# EasyEDA Pro project 宠物喂食机-V1.eprj

# Schematic Schematic1
Create Date: 2023-04-14; Page Name: P1; Project Name: 宠物喂食机-V1; Schematic Name: Schematic1; Update Date: 2023-04-15; Company: 嘉立创EDA; Page Size: A4; Version: V1.0
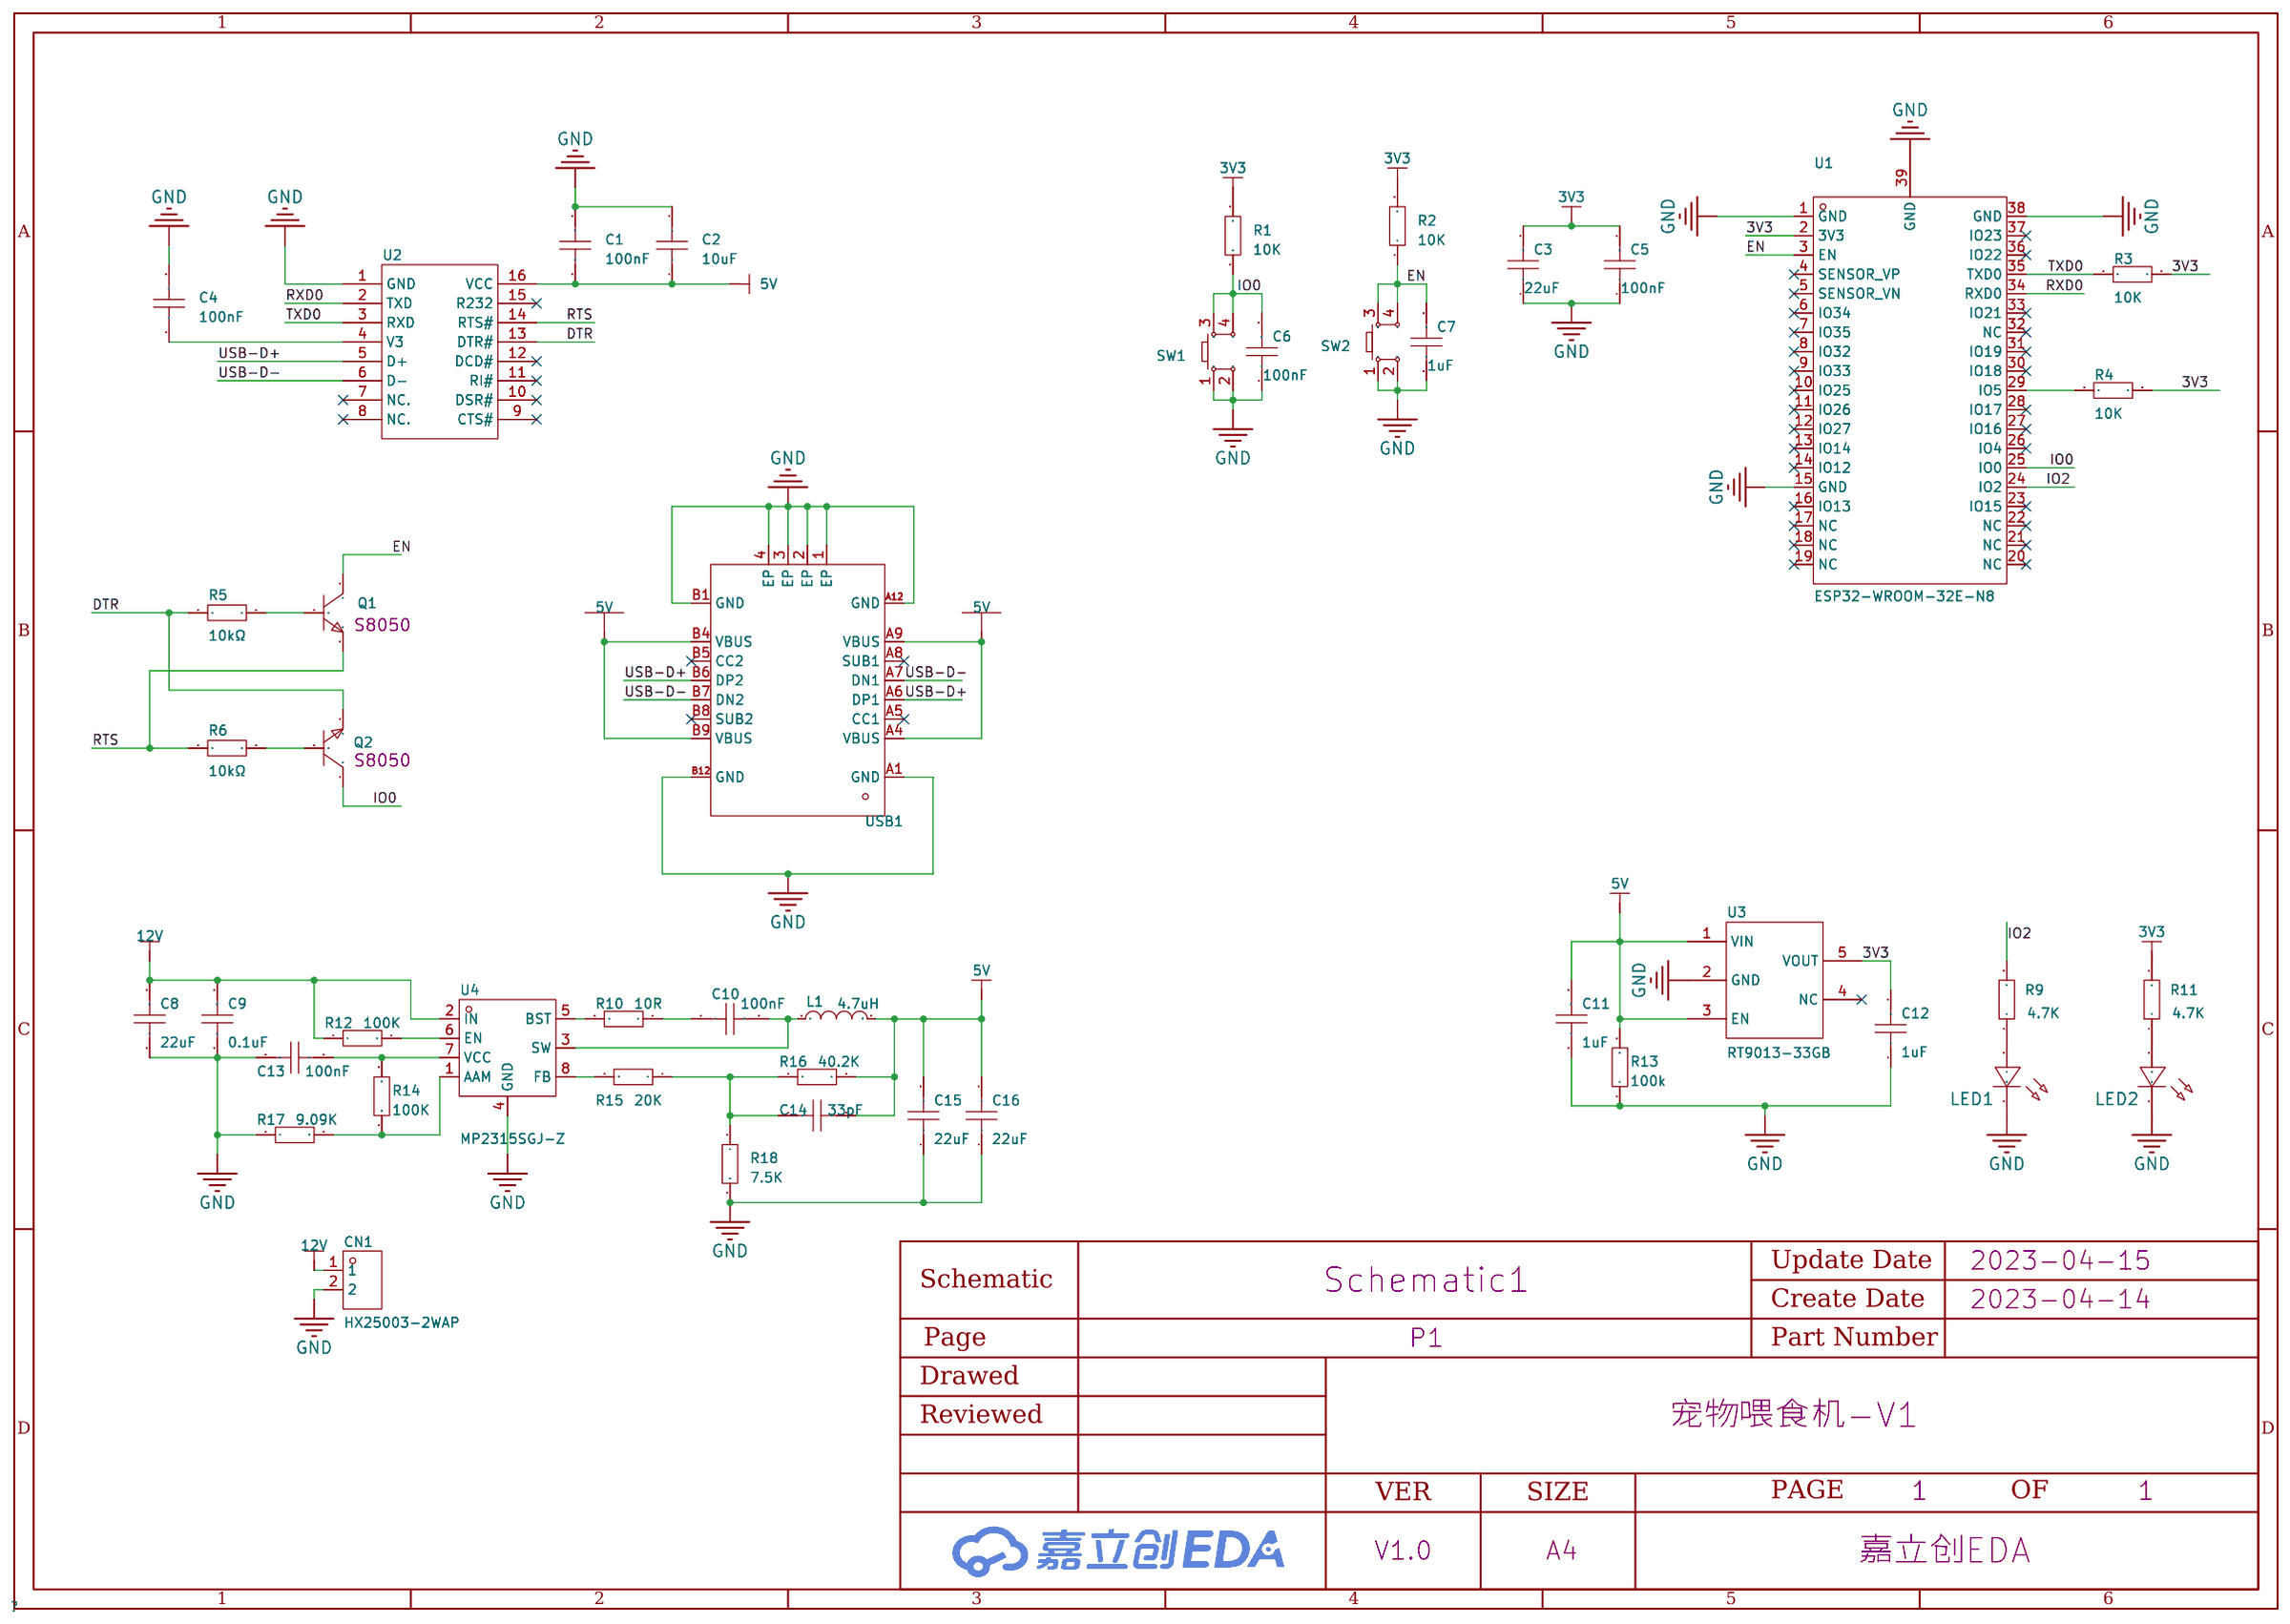
[diagram p0: schematic sheet]

## Parts
C1  100nF  [C0603]
C2  10uF  [C0603]
C3  22uF  [C0603]
C4  100nF  [C0603]
C5  100nF  [C0603]
C6  100nF  [C0603]
C7  1uF  [C0603]
C8  22uF  [C1206]
C9  0.1uF  [C0805]
C10  100nF  [C0603]
C11  1uF  [C0603_1]
C12  1uF  [C0603_1]
C13  100nF  [C0603]
C14  33pF  [C0603]
C15  22uF  [C0805]
C16  22uF  [C0805]
CN1  HX25003-2WAP  [CONN-TH_2P-P2.50_HX25003-2WAP]
L1  4.7uH  [IND-SMD_L7.3-W6.6]
LED1  -  [LED_0603]
LED2  -  [LED_0603]
Q1  -  [S8050_SOT-23]
Q2  -  [S8050_SOT-23]
R1  10K  [R0603]
R2  10K  [R0603]
R3  10K  [R0603]
R4  10K  [R0603]
R5  10kΩ  [R0603]
R6  10kΩ  [R0603]
R9  4.7K  [R0603]
R10  10R  [R0603]
R11  4.7K  [R0603]
R12  100K  [R0603]
R13  100k  [R0603]
R14  100K  [R0603]
R15  20K  [R0603]
R16  40.2K  [R0603]
R17  9.09K  [R0603]
R18  7.5K  [R0603]
SW1  -  [KEY-SMD_4P-L4.5-W4.5-P3.00-LS6.8]
SW2  -  [KEY-SMD_4P-L4.5-W4.5-P3.00-LS6.8]
U1  ESP32-WROOM-32E-N8  [WIFI-SMD_ESP32-WROOM-32E]
U2  CH340C  [SOP-16_L10.0-W3.9-P1.27-LS6.0-BL]
U3  RT9013-33GB  [SOT-23-5_L3.0-W1.7-P0.95-LS2.8-BL]
U4  MP2315SGJ-Z  [TSOT-23-8_L2.9-W1.6-P0.65-LS2.8-BL]
USB1  -  [USB-C-SMD_KH-TYPE-C-16P_1]

## Library data of the parts
C1-C7 = CAP_0805: Supplier Footprint: 0805
C8 = CAP_1206: Supplier Footprint: 1206
C9 C10 C14-C16 = CAP_0603: Supplier Footprint: 0603
C11 C12 = CAP_604: Supplier Footprint: 0603; Check: true
C13 = CL05B104KO5NNNC: 容值:100nF;精度:±10%;额定电压:16V;材质(温度系数):X7R;; LCSC Part Name: 100nF ±10% 16V; Supplier Part: C1525; Manufacturer: SAMSUNG(三星); Supplier Footprint: 0402; JLCPCB Part Class: Basic Part; Datasheet: https://atta.szlcsc.com/upload/public/pdf/source/20160103/1457707674891.pdf; Supplier: LCSC; Tolerance: ±10%; Voltage Rated: 16V; Temperature Coefficient: X7R
CN1 = HX25003-2WAP: 参考系列:XH;间距:2.5mm;插针结构:1x2P;排数:1;每排PIN数:2;行距:-;公母:公型插针;安装方式:弯插;额定电流:-;工作温度范围:-;; LCSC Part Name: XH 2.5mm 1x2P 弯插 母座; Supplier Part: C442326; Manufacturer: HX(红星); Supplier Footprint: 插件,P=2.5mm; JLCPCB Part Class: Extended Part; Datasheet: https://atta.szlcsc.com/upload/public/pdf/source/20191028/C442326_951D1FF48F4BC139C99E649B2A876D28.pdf; Supplier: LCSC; Reference Series: XH; Pitch: 2.5mm; Pins Structure: 1x2P; Number of Rows: 1; Number of PINs Per Row: 2; Gender: 公型插针; Mounting Style: 弯插
L1 = MCS0630-4R7MPY1: 电感值:4.7uH;精度:±20%;额定电流:5.5A;饱和电流(Isat):7A;; LCSC Part Name: 4.7uH ±20% 5.5A 37mΩ; Supplier Part: C2937097; Manufacturer: PSA(信昌电陶); Supplier Footprint: 0630; JLCPCB Part Class: Extended Part; Datasheet: https://atta.szlcsc.com/upload/public/pdf/source/20220121/EA6E6E6F70ED7BAE67EC293805EAAACB.pdf; Supplier: LCSC; Tolerance: ±20%; Rated Current: 5.5A; Saturation Current (Isat): 7A; DC Resistance (DCR): 37mΩ
LED1 LED2 = LED_0603-R: Supplier Footprint: 0603; Check: true
Q1 Q2 = S8050_SOT_NPN: Supplier Footprint: SOT-23; Manufacturer Part: S8050
R1-R4 R9-R18 = Res_0603: Supplier Footprint: 0603; Check: true
R5 R6 = 0402WGF1202TCE: 电阻类型:厚膜电阻;阻值:12kΩ;精度:±1%;功率:62.5mW;温度系数:±100ppm/℃;最大工作电压:50V;工作温度范围:-55℃~+155℃;; LCSC Part Name: 12kΩ ±1% 62.5mW; Supplier Part: C25752; Manufacturer: UNI-ROYAL(厚声); Supplier Footprint: 0402; JLCPCB Part Class: Basic Part; Datasheet: https://atta.szlcsc.com/upload/public/pdf/source/20200306/C422600_1E6D84923E4A46A82E41ADD87F860B5C.pdf; Supplier: LCSC; Type: 厚膜电阻; Tolerance: ±1%; Power(Watts): 62.5mW; Temperature Coefficient: ±100ppm/℃; Overload Voltage (Max): 50V; Operating Temperature Range: -55℃~+155℃
SW1 SW2 = Key_SMD_12x12x7.3: Supplier Footprint: SMD
U1 = ESP32-WROOM-32E-N8_C701342: ESP32-WROOM-32E 集成 ESP32-D0WD-V3 芯片，具有?高的稳定性和安全性能。; LCSC Part Name: PCB板载天线模组; Supplier Part: C701342; Manufacturer: ESPRESSIF(乐鑫); Supplier Footprint: SMD-38P,18x25.5x3.1mm; JLCPCB Part Class: Extended Part; Datasheet: https://atta.szlcsc.com/upload/public/pdf/source/20200730/C701341_95E089979D39CD8D2471FDC7C7AF29A1.pdf; Supplier: LCSC
U2 = CH340C: 类型:Transceiver;协议类别:USB 2.0;驱动器/接收器数:-;数据速率:2Mbps;; Supplier Part: C84681; Manufacturer: WCH(南京沁恒); Supplier Footprint: SOP-16_150mil; JLCPCB Part Class: 扩展库; Datasheet: https://atta.szlcsc.com/upload/public/pdf/source/20200819/C84681_ADBED554CE321879DBD6B1D06488689C.pdf; Supplier: LCSC; Type: Transceiver; Protocol: USB 2.0; Data Rate: 2Mbps; Supply Voltage: 3.3V, 5V
U3 = RT9013-33GB: 输出类型:固定;输出极性:正;输出通道数:1;最大输入电压:5.5V;输出电压:3.3V;压差:400mV@(500mA);静态电流(地电流):-;输出电流:500mA;电源纹波抑制比(PSRR):50dB@(10kHz);噪声:-;特性:-;; LCSC Part Name: 正 Vin=5.5V Vout=3.3V 500mA 50dB@(10kHz); Supplier Part: C47773; Manufacturer: RICHTEK(立锜); Supplier Footprint: SOT-23-5; JLCPCB Part Class: Extended Part; Datasheet: https://atta.szlcsc.com/upload/public/pdf/source/20150504/1457707282459.pdf; Supplier: LCSC; Output Type: 固定; Output Polarity: 正; Number of Outputs: 1; Maximum Input Voltage: 5.5V; Output Voltage: 3.3V; Dropout Voltage: 400mV@(500mA); Output Current: 500mA; Power Supply Rejection Ratio (PSRR): 50dB@(10kHz)
U4 = MP2315SGJ-Z: Supplier Part: C3031493; Supplier Footprint: TSOT23-8; JLCPCB Part Class: Extended Part; Datasheet: https://atta.szlcsc.comnull; Supplier: LCSC
USB1 = kh-type-c-16p_2: Type-C母座 16PIN 立式四角贴板无压片; LCSC Part Name: Type-C母座; Supplier Part: C709357; Manufacturer: kinghelm(金航标); Manufacturer Part: KH-TYPE-C-16P; LCSC Stock: 5637; LCSC On Sale: 1; Price: 0.484; JLCPCB Part Class: Extended Part; JLCPCB Stock: 2220; JLCPCB On Sale: 1; Datasheet: https://atta.szlcsc.com/upload/public/pdf/source/20200911/C709357_AA8DCEB38BB20E3035A7ED7AE7667837.pdf; Supplier: LCSC; Check: true

## Nets
3V3: C3.2 C5.2 C12.2 R1.2 R2.2 R3.1 R4.1 R11.2 U1.2(3V3) U3.5(VOUT)
5V: C1.1 C2.1 C11.2 C14.2 C15.2 C16.2 L1.2 R13.2 R16.2 U2.16(VCC) U3.1(VIN) U3.3(EN) USB1.A4(VBUS) USB1.A9(VBUS) USB1.B4(VBUS) USB1.B9(VBUS)
12V: C8.2 C9.2 CN1.1 R12.1 U4.2(IN)
GND: C1.2 C2.2 C3.1 C4.2 C5.1 C6.1 C7.1 C8.1 C9.1 C11.1 C12.1 C13.2 C15.1 C16.1 CN1.2 LED1.1(C) LED2.1(C) R13.1 R17.1 R18.2 SW1.1 SW1.2 SW2.1 SW2.2 U1.1(GND) U1.15(GND) U1.38(GND) U1.39(GND) U2.1(GND) U3.2(GND) U4.4(GND) USB1.1(EP) USB1.2(EP) USB1.3(EP) USB1.4(EP) USB1.A1(GND) USB1.A12(GND) USB1.B1(GND) USB1.B12(GND)
DTR: Q2.2 R5.1 U2.13(DTR#)
EN: C7.2 Q1.3 R2.1 SW2.3 SW2.4 U1.3(EN)
IO0: C6.2 Q2.3 R1.1 SW1.3 SW1.4 U1.25(IO0)
IO2: R9.2 U1.24(IO2)
RTS: Q1.2 R6.1 U2.14(RTS#)
RXD0: U1.34(RXD0) U2.2(TXD)
TXD0: R3.2 U1.35(TXD0) U2.3(RXD)
USB-D+: U2.5(D+) USB1.A6(DP1) USB1.B6(DP2)
USB-D-: U2.6(D-) USB1.A7(DN1) USB1.B7(DN2)
$C4_1: C4.1 U2.4(V3)
$C10_1: C10.1 R10.1
$C10_2: C10.2 L1.1 U4.3(SW)
$C13_1: C13.1 R14.2 U4.7(VCC)
$C14_1: C14.1 R15.1 R16.1 R18.1
$LED1_2: LED1.2(A) R9.1
$LED2_2: LED2.2(A) R11.1
$Q1_1: Q1.1 R5.2
$Q2_1: Q2.1 R6.2
$R4_2: R4.2 U1.29(IO5)
$R10_2: R10.2 U4.5(BST)
$R12_2: R12.2 U4.6(EN)
$R14_1: R14.1 R17.2 U4.1(AAM)
$R15_2: R15.2 U4.8(FB)

Not connected (* = marked no-connect by the designer): U1 4(SENSOR_VP)* 5(SENSOR_VN)* 6(IO34)* 7(IO35)* 8(IO32)* 9(IO33)* 10(IO25)* 11(IO26)* 12(IO27)* 13(IO14)* 14(IO12)* 16(IO13)* 17(NC)* 18(NC)* 19(NC)* 20(NC)* 21(NC)* 22(NC)* 23(IO15)* 26(IO4)* 27(IO16)* 28(IO17)* 30(IO18)* 31(IO19)* 32(NC)* 33(IO21)* 36(IO22)* 37(IO23)*; U2 7(NC.)* 8(NC.)* 9(CTS#)* 10(DSR#)* 11(RI#)* 12(DCD#)* 15(R232)*; U3 4(NC)*; USB1 A5(CC1)* A8(SUB1)* B5(CC2)* B8(SUB2)*

# Board PCB2
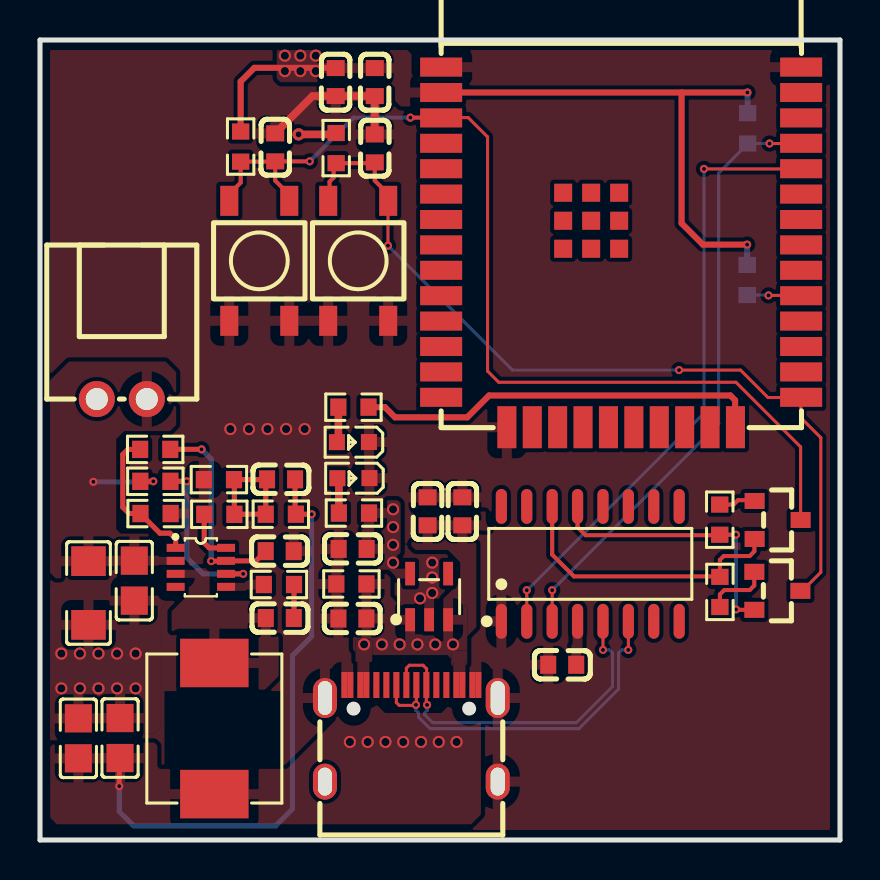
[diagram p1: board, top side]
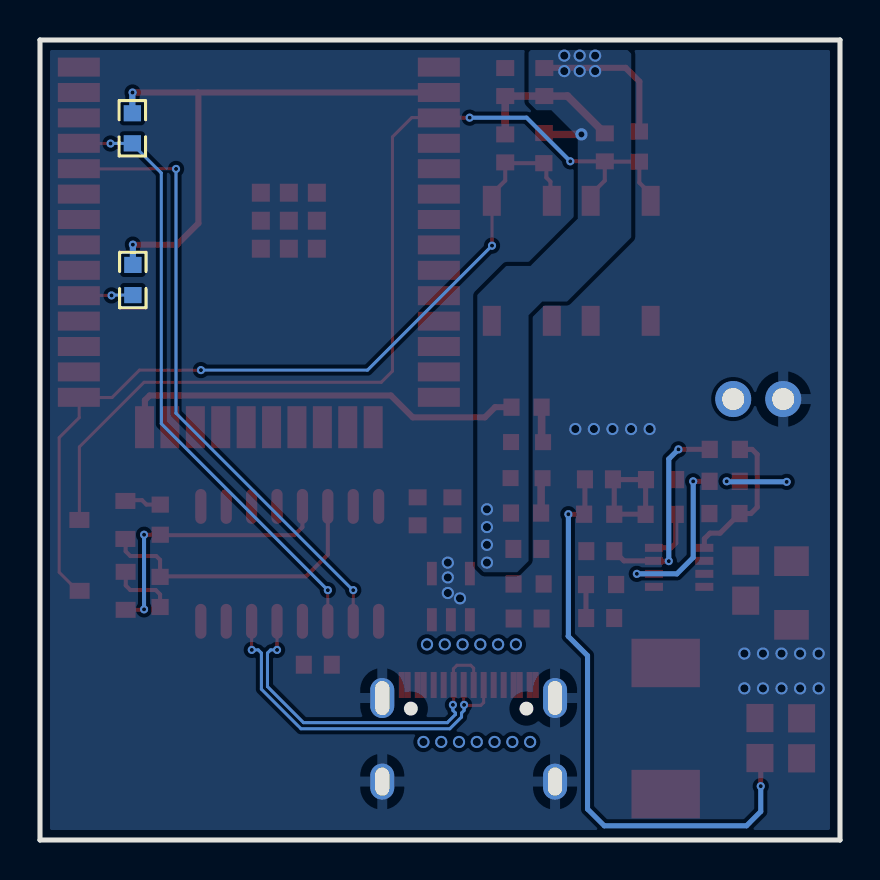
[diagram p2: board, bottom side, seen from below]

Outline 40 x 40 mm; copper layers: Top Layer, Bottom Layer. Coordinates in mm from the lower left corner of the outline.
Outline path: 0,0 0,40 40,40 40,0 0,0
Stack: Top Layer 0.035mm / Dielectric1 1.51mm FR4 er 4.5 / Bottom Layer 0.035mm

## Design rules (mm)
net GND: PWR
net USB-D+: DP1
net USB-D-: DP1
net 5V: PWR
net 3V3: PWR
net 12V: PWR
spacing safeClearance (default): track to track 0.152, other pairs 0.152 to 0.508
track width trackWidth (default): min 0.127, default 0.254, max 2.54
differential pair differentialPair (default): width min 0.127, default 0.254, max 2.54; gap min 0.152, default 0.152
via viaSize (default): diameter min 0.406, default 0.61, max 10; hole min 0.203, default 0.305, max 5.999

## Placement (name value [footprint] x y rotation side)
C1  100nF  [C0603]  21.12 16.43 90 top
C2  10uF  [C0603]  19.38 16.43 90 top
C3  22uF  [C0603]  14.78 37.9 90 top
C4  100nF  [C0603]  26.11 8.76 180 top
C5  100nF  [C0603]  16.74 37.9 90 top
C6  100nF  [C0603]  16.74 34.58 270 top
C7  1uF  [C0603]  11.76 34.63 270 top
C8  22uF  [C1206]  2.42 12.35 90 top
C9  0.1uF  [C0805]  4.72 12.97 90 top
C10  100nF  [C0603]  11.99 11.1 180 top
C11  1uF  [C0603_1]  15.62 11.07 0 top
C12  1uF  [C0603_1]  15.63 14.55 0 top
C13  100nF  [C0603]  11.99 14.44 0 top
C14  33pF  [C0603]  12.05 18.03 0 top
C15  22uF  [C0805]  4 5.1 270 top
C16  22uF  [C0805]  1.92 5.08 270 top
CN1  HX25003-2WAP  [CONN-TH_2P-P2.50_HX25003-2WAP]  4.09 22.05 180 top
L1  4.7uH  [IND-SMD_L7.3-W6.6]  8.72 5.57 90 top
LED1  -  [LED_0603]  15.6 19.89 180 top
LED2  -  [LED_0603]  15.62 18.08 180 top
Q1  -  [S8050_SOT-23]  36.88 16.13 180 top
Q2  -  [S8050_SOT-23]  36.87 12.59 180 top
R1  10K  [R0603]  14.81 34.59 90 top
R2  10K  [R0603]  10.03 34.67 90 top
R3  10K  [R0603]  35.38 35.59 270 bottom
R4  10K  [R0603]  35.36 28 270 bottom
R5  10kΩ  [R0603]  33.99 16.02 90 top
R6  10kΩ  [R0603]  34 12.4 270 top
R9  4.7K  [R0603]  15.67 21.64 0 top
R10  10R  [R0603]  11.95 12.77 180 top
R11  4.7K  [R0603]  15.7 16.35 0 top
R12  100K  [R0603]  5.77 17.94 0 top
R13  100k  [R0603]  15.57 12.8 0 top
R14  100K  [R0603]  5.76 19.53 0 top
R15  20K  [R0603]  8.97 16.28 180 top
R16  40.2K  [R0603]  12.04 16.29 0 top
R17  9.09K  [R0603]  5.78 16.32 180 top
R18  7.5K  [R0603]  8.95 18.02 180 top
SW1  -  [KEY-SMD_4P-L4.5-W4.5-P3.00-LS6.8]  15.91 28.96 90 top
SW2  -  [KEY-SMD_4P-L4.5-W4.5-P3.00-LS6.8]  10.97 28.96 90 top
U1  ESP32-WROOM-32E-N8  [WIFI-SMD_ESP32-WROOM-32E]  29.06 29.64 270 top
U2  CH340C  [SOP-16_L10.0-W3.9-P1.27-LS6.0-BL]  27.51 13.81 0 top
U3  RT9013-33GB  [SOT-23-5_L3.0-W1.7-P0.95-LS2.8-BL]  19.46 12.17 0 top
U4  MP2315SGJ-Z  [TSOT-23-8_L2.9-W1.6-P0.65-LS2.8-BL]  8.04 13.63 270 top
USB1  -  [USB-C-SMD_KH-TYPE-C-16P_1]  18.57 5.33 0 top

## Footprints (pads in the part's own frame, mm; a bottom-side part is the same pattern mirrored in y, then rotated)
C0603
  rect 0.8x0.9 smd: 1(-0.7,0) 2(0.7,0)
C0603_1
  rect 0.8x0.9 smd: 1(-0.7,0) 2(0.7,0)
C0805
  rect 1.41x1.35 smd: 1(-1,0) 2(1,0)
C1206
  rect 1.485x1.728 smd: 1(-1.593,0) 2(1.593,0)
CONN-TH_2P-P2.50_HX25003-2WAP
  round 1.8 hole 1.1: 1(-1.25,0) 2(1.25,0)
IND-SMD_L7.3-W6.6
  rect 2.424x3.42 smd: 1(3.278,0) 2(-3.278,0)
KEY-SMD_4P-L4.5-W4.5-P3.00-LS6.8
  rect 1.5x0.9 smd: 1(-3,1.5) 2(-3,-1.5) 3(3,-1.5) 4(3,1.5)
LED_0603
  rect 0.8x0.8 smd: 1(-0.851,-0.01) 2(0.75,-0.005)
R0603
  rect 0.806x0.864 smd: 1(-0.753,0) 2(0.753,0)
S8050_SOT-23
  rect 1x0.8 smd: 1(1.15,-0.823) 2(1.15,1.077) 3(-1.15,0.127)
SOP-16_L10.0-W3.9-P1.27-LS6.0-BL
  oval 0.56x1.745 smd: 1(-4.445,-2.873) 2(-3.175,-2.873) 3(-1.905,-2.873) 4(-0.635,-2.873) 5(0.635,-2.873) 6(1.905,-2.873) 7(3.175,-2.873) 8(4.445,-2.873) 9(4.445,2.873) 10(3.175,2.873) 11(1.905,2.873) 12(0.635,2.873) 13(-0.635,2.873) 14(-1.905,2.873) 15(-3.175,2.873) 16(-4.445,2.873)
SOT-23-5_L3.0-W1.7-P0.95-LS2.8-BL
  rect 0.49x1.157 smd: 1(-0.95,-1.153) 2(0,-1.153) 3(0.95,-1.153)
  rect 0.49x1.175 smd: 4(0.95,1.153) 5(-0.95,1.153)
TSOT-23-8_L2.9-W1.6-P0.65-LS2.8-BL
  rect 0.4x0.9 smd: 1(-0.975,-1.26) 2(-0.325,-1.26) 3(0.325,-1.26) 4(0.975,-1.26) 5(0.975,1.26) 6(0.325,1.26) 7(-0.325,1.26) 8(-0.975,1.26)
USB-C-SMD_KH-TYPE-C-16P_1
  oval 1.2x2 hole 0.7x1.7: 1(-4.32,1.765) 2(4.32,1.765)
  oval 1.2x1.8 hole 0.7x1.4: 3(-4.32,-2.415) 4(4.32,-2.415)
  rect 0.3x1.3 smd: A1(-3.35,2.415) A4(-2.55,2.415) A5(-1.25,2.415) A6(-0.25,2.415) A7(0.25,2.415) A8(1.25,2.415) A9(2.55,2.415) A12(3.35,2.415) B1(3.05,2.415) B4(2.25,2.415) B5(1.75,2.415) B6(0.75,2.415) B7(-0.75,2.415) B8(-1.75,2.415) B9(-2.25,2.415) B12(-3.05,2.415)
WIFI-SMD_ESP32-WROOM-32E
  rect 0.95x2.1 smd: 1(-9.002,-9) 2(-7.732,-9) 3(-6.463,-9) 4(-5.192,-9) 5(-3.922,-9) 6(-2.652,-9) 7(-1.383,-9) 8(-0.113,-9) 9(1.157,-9) 10(2.428,-9) 11(3.697,-9) 12(4.968,-9) 13(6.237,-9) 14(7.508,-9) 25(7.508,9) 26(6.237,9) 27(4.968,9) 28(3.697,9) 29(2.428,9) 30(1.157,9) 31(-0.113,9) 32(-1.383,9) 33(-2.652,9) 34(-3.922,9) 35(-5.192,9) 36(-6.463,9) 37(-7.732,9) 38(-9.002,9)
  rect 2.1x0.95 smd: 15(9.002,-5.715) 16(9.002,-4.445) 17(9.002,-3.175) 18(9.002,-1.905) 19(9.002,-0.635) 20(9.002,0.635) 21(9.002,1.905) 22(9.002,3.175) 23(9.002,4.445) 24(9.002,5.715)
  rect 0.9x0.9 smd: 39(-2.721,-0.1) 39(-2.721,-1.5) 39(-2.721,-2.9) 39(-1.321,-0.1) 39(-1.321,-1.5) 39(-1.321,-2.9) 39(0.079,-0.1) 39(0.079,-1.5) 39(0.079,-2.9)

## Nets
As in the schematic.

Pads without a net: U1 4 5 6 7 8 9 10 11 12 13 14 16 17 18 19 20 21 22 23 26 27 28 30 31 32 33 36 37; U2 7 8 9 10 11 12 15; U3 4; USB1 A5 A8 B5 B8

## Via types
v1: diameter 0.61, hole 0.406, Top Layer to Bottom Layer, 42 vias
v2: diameter 0.406, hole 0.203, Top Layer to Bottom Layer, 25 vias
v3: diameter 0.61, hole 0.305, Top Layer to Bottom Layer, 1 via

## Routing (per net, layer and track width the routed paths; a pad name or vN(x,y) marks a point on that pad's centre or on a via; arc(x,y) is an arc through that point)
3V3: length 37.1
  Top Layer w0.305: R2.2 10.03,37.92 10.72,38.61 14.77,38.61 14.78,38.6 ; 32.1,37.37 U1.2 ; 32.1,37.37 v2(35.37,37.37) ; 32.1,37.37 32.08,37.35 32.08,30.84 33.15,29.77 v2(35.36,29.77)
  Top Layer w0.381: R1.2 14.74,35.28 v3(12.93,35.28)
  Bottom Layer w0.305: R3.1 35.38,37.36 v2(35.37,37.37) ; R4.1 v2(35.36,29.77)
  vias: v1(12.24,39.22) v1(12.24,38.44) v1(13.02,39.22) v1(13.02,38.44) v1(13.79,39.22) v1(13.79,38.44) v1(17.65,16.54) v1(17.65,15.65) v1(17.65,14.76) v1(17.65,13.87)
5V: length 29.7
  Top Layer w0.254: v2(13.58,16.29) R16.2 12.75,16.33 C14.2 ; 3.8,4.1 3.96,3.93 v2(3.96,2.69)
  Bottom Layer w0.254: v2(13.58,16.29) 13.58,10.19 13.59,10.19 12.62,9.22 12.62,1.55 11.79,0.71 4.67,0.71 3.96,1.42 v2(3.96,2.69)
  vias: v1(15.49,4.9) v1(16.21,9.78) v1(16.38,4.9) v1(17.09,9.78) v1(17.27,4.9) v1(17.98,9.78) v1(18.16,4.9) v1(18.87,9.78) v1(19.05,4.9) v1(19.76,9.78) v1(19.94,4.9) v1(20.65,9.78) v1(20.83,4.9)
12V: length 3.7
  Top Layer w0.254: v2(5.67,17.94) R12.1
  Bottom Layer w0.254: v2(5.67,17.94) 5.64,17.91 v2(2.67,17.91)
GND: length 7.7
  Top Layer w0.381: C6.1 C5.1 C3.1 13.63,37.2 C7.1
  vias: v1(1.07,9.32) v1(1.07,7.58) v1(2,9.32) v1(2,7.58) v1(2.92,9.32) v1(2.92,7.58) v1(3.85,9.32) v1(3.85,7.58) v1(4.78,9.32) v1(4.78,7.58) v1(9.52,20.55) v1(10.45,20.55) v1(11.38,20.55) v1(12.31,20.55) v1(13.23,20.55) v1(19,12.08) v1(19.61,13.87) v1(19.61,13.13) v1(19.61,12.35)
$C10_1: length 1.7
  Top Layer w0.254: R10.1 12.7,11.11 C10.1
$C13_1: length 10.3
  Top Layer w0.254: R14.2 6.52,19.53 v2(8.08,19.53) ; 11.28,14.44 10.8,13.96 U4.7 9.29,13.94 v2(8.56,13.94)
  Bottom Layer w0.254: v2(8.56,13.94) 8.56,19.05 v2(8.08,19.53)
$C14_1: length 6.7
  Top Layer w0.254: R18.1 11.34,18.02 ; 11.34,18.02 11.29,17.97 R16.1 9.72,16.29 R15.1 9.72,17.97 ; 11.34,18.02 C14.1
$LED1_2: length 1.8
  Top Layer w0.381: R9.1 14.92,19.97 14.85,19.89
$LED2_2: length 1.8
  Top Layer w0.381: R11.1 14.94,18.02 LED2.2
$Q1_1: length 1.8
  Top Layer w0.203: 35.72,16.96 35.69,16.99 34.9,16.99 34.68,16.77 R5.2
$Q2_1: length 3.2
  Top Layer w0.203: Q2.1 35.71,13.4 35.71,12.73 35.48,12.5 34.21,12.5 34,12.28 R6.2
$R4_2: length 2.7
  Top Layer w0.152: U1.29 38.04,27.23 v2(36.42,27.23)
  Bottom Layer w0.152: v2(36.42,27.23) 36.41,27.25 R4.2
$R12_2: length 8.6
  Top Layer w0.254: U4.6 v2(10.16,13.31) 10.16,13.31 ; 6.52,17.94 7.34,17.94 v2(7.34,17.93)
  Bottom Layer w0.254: v2(7.34,17.93) 7.34,14.12 8.16,13.31 v2(10.16,13.31)
$R14_1: length 7.4
  Top Layer w0.254: R14.1 4.39,19.53 4.14,19.28 4.14,16.64 4.46,16.32 R17.2 5.03,16.31 5.99,15.34 6.5,15.34 6.78,15.06 U4.1
$R15_2: length 2.6
  Top Layer w0.254: R15.2 8.21,14.85 8.46,14.61 9.3,14.61 U4.8
DTR: length 13.8
  Top Layer w0.203: v2(34.8,11.53) 34.82,11.51 Q2.2 ; v2(34.8,15.26) R5.1 33.96,15.24 27.28,15.24 26.88,15.64 U2.13
  Bottom Layer w0.203: 34.8,15.26 v2(34.8,11.53)
EN: length 50.7
  Top Layer w0.152: Q1.3 38.03,19.65 34.8,22.89 22.94,22.89 22.38,23.44 22.38,35.15 21.41,36.12 20.07,36.12 U1.3
  Top Layer w0.203: C7.2 11.75,33.92 R2.1 10.03,32.87 9.47,32.3 SW2.4 ; C7.2 11.76,32.97 12.47,32.26 SW2.3 ; C7.2 13.48,33.93 v2(13.49,33.93) ; v2(18.52,36.12) 20.04,36.12
  Bottom Layer w0.203: v2(13.49,33.93) 15.67,36.12 v2(18.52,36.12)
IO0: length 42.8
  Top Layer w0.152: SW1.3 17.4,31.95 v2(17.4,29.72) ; 38.04,22.12 36.4,22.12 35.03,23.5 v2(31.95,23.5) ; 38.04,22.12 38.04,21.12 39.04,20.12 39.04,13.39 38.11,12.46 Q2.3 ; 38.04,22.12 38.04,22.15 ; 38.04,22.12 38.05,22.12 U1.25
  Top Layer w0.203: R1.1 16.7,33.84 C6.2 16.74,32.97 17.41,32.3 SW1.3 ; SW1.4 14.48,32.03 14.48,32.92 14.68,33.12 14.68,33.84
  Bottom Layer w0.152: v2(31.95,23.5) 23.62,23.5 v2(17.4,29.72)
IO2: length 20.4
  Top Layer w0.305: 16.43,21.64 17.25,21.64 17.75,21.13 21.36,21.13 22.45,22.22 34.52,22.22 34.75,21.99 34.75,20.65
RTS: length 14.6
  Top Layer w0.203: U2.14 25.61,14.27 26.7,13.18 33.97,13.18 R6.1 34,14.01 34.19,14.2 35.48,14.2 35.72,14.43 35.72,15.06
RXD0: length 31.2
  Top Layer w0.152: U1.34 38.05,33.55 v2(33.2,33.55) ; U2.2 v2(24.34,12.49)
  Bottom Layer w0.152: v2(24.34,12.49) 24.35,12.49 33.2,21.34 v2(33.2,33.55)
TXD0: length 30.6
  Top Layer w0.152: v2(36.47,34.82) 38.05,34.82 U1.35 ; U2.3 v2(25.61,12.49)
  Bottom Layer w0.152: v2(25.61,12.49) 33.93,20.82 33.93,33.35 35.38,34.8 R3.2 36.47,34.83
  Bottom Layer w0.203: v2(36.47,34.82) 36.47,34.83
USB-D+: length 18.3
  Top Layer w0.152: v2(19.35,6.76) 19.32,6.79 19.32,7.75 19.33,7.76 19.33,8.56 19.15,8.74 18.47,8.74 18.32,8.59 18.32,7.75 ; U2.5 v2(28.15,9.5)
  Bottom Layer w0.152: v2(28.15,9.5) 28.47,9.5 28.63,9.35 28.63,7.67 26.82,5.87 19.63,5.87 19.23,6.27 19.23,6.35 19.35,6.48 v2(19.35,6.76)
USB-D-: length 18.4
  Top Layer w0.152: 17.82,7.75 17.82,6.87 17.96,6.73 18.77,6.73 v2(18.8,6.76) 18.82,6.78 18.82,7.75 ; U2.6 29.42,9.51 v2(29.41,9.5)
  Bottom Layer w0.152: v2(18.8,6.76) 18.8,6.48 18.92,6.35 18.92,6.15 19.51,5.56 26.95,5.56 28.93,7.54 28.93,9.35 29.09,9.5 v2(29.41,9.5)

## Copper pours and planes (outline as drawn; the poured copper is in the pictures)
3V3 on Top Layer: 17.88,16.99 18.03,16.84 18.03,14.38 18.24,14.17 18.9,14.17 19.02,14.05 19.02,12.65 18.9,12.52 17.86,12.52 17.78,12.6 17.78,13.18 17.45,13.51 15.75,13.51 15.62,13.64 15.62,16.81 15.8,16.99
3V3 on Top Layer: 12.01,39.67 18.19,39.67 18.58,39.29 18.58,38.3 18.88,38 21.21,38 21.44,37.77 21.44,36.88 21.23,36.68 18.03,36.68 17.75,36.96 17.75,37.62 17.48,37.89 12.02,37.89 11.84,38.07 11.84,39.5
3V3 on Bottom Layer: 15.29,39.67 15.57,39.4 15.57,36.88 15.18,36.49 14.44,36.49 13.11,35.17 13.11,31.07 15.47,28.7 16.69,28.7 18.14,27.25 18.14,13.72 17.81,13.39 16.14,13.39 15.57,13.95 15.57,26.24 14.88,26.92 13.64,26.92 10.44,30.12 10.44,39.32 10.79,39.67
5V on Top Layer: 18.72,10.29 19.91,10.29 20.04,10.41 20.04,11.68 20.09,11.73 21.26,11.73 21.36,11.63 21.36,8.81 21.12,8.56 20.78,8.56 20.55,8.79 20.55,9.07 20.37,9.25 18.64,9.25 18.64,10.21
5V on Top Layer: 15.8,13.31 17.32,13.31 17.53,13.11 17.53,12.19 17.98,11.73 18.83,11.73 18.92,11.63 18.92,9.4 18.77,9.25 15.93,9.25 15.65,9.53 15.65,13.16
5V on Top Layer: 20.72,16.43 22.37,16.43 22.53,16.59 22.53,17.47 22.71,17.65 23.55,17.65 23.7,17.5 23.7,15.72 23.44,15.47 20.67,15.47 20.4,15.74 20.4,16.11
5V on Top Layer: 21.65,16.31 21.82,16.14 21.82,14.91 21.82,10.64 21.31,10.13 20.4,10.13 20.19,10.11 19.96,9.96 19.96,11.86 21.01,12.9 21.01,13.89 20.4,14.5 18.77,14.5 18.57,14.71 18.57,16.15 18.72,16.31
5V on Top Layer: 0.74,4.88 5.72,4.88 5.87,4.72 5.87,3.68 5.99,3.56 12.34,3.56 14.78,5.99 14.78,6.27 15.77,7.26 15.77,9.96 15.84,10.02 16.55,10.02 16.61,9.96 16.61,6.98 17.25,6.35 20.07,6.35 20.57,6.86 20.57,9.47 21.34,9.47 21.36,9.45 21.36,7.38 22.05,6.7 22.05,1.27 21.56,0.79 0.84,0.79 0.51,1.12 0.51,4.65
12V on Top Layer: 1.45,23.93 6.27,23.93 6.81,23.39 6.81,20.75 6.5,20.45 4.22,20.45 3.81,20.04 3.81,15.55 4.04,15.32 5.38,15.32 5.89,14.81 5.89,14.4 6.1,14.2 7.21,14.2 7.31,14.1 7.31,13.83 7.2,13.72 6.2,13.72 5.56,13.08 0.79,13.08 0.46,13.41 0.46,22.94
GND on Top Layer: -1.32,41.43 40.77,41.43 40.77,-1.07 -1.32,-1.07
GND on Top Layer: 0.61,12.8 6.1,12.8 6.3,13 7.21,13 7.31,12.9 7.31,12.44 7.17,12.3 6.79,12.3 6.04,11.56 6.04,5.66 5.69,5.31 0.77,5.31 0.37,5.7 0.37,12.57
GND on Bottom Layer: -1.73,-0.84 40.36,-0.84 40.36,41.66 -1.73,41.66
$C4_1 on Top Layer: 26.71,11.87 27.08,11.87 27.23,11.72 27.23,10.08 27.43,9.88 27.43,8.39 27.23,8.2 26.42,8.2 26.29,8.33 26.29,9.83 26.57,10.11 26.57,11.72
$C10_2 on Top Layer: 6.32,13.59 6.25,13.51 6.25,13.13 6.32,13.06 7.29,13.06 7.42,12.93 7.42,12.27 6.58,11.43 6.58,7.9 6.96,7.52 11.25,7.52 11.94,8.2 11.94,11.53 11.51,11.96 8.79,11.96 8.48,12.27 8.48,13.39 8.28,13.59
$R10_2 on Top Layer: 8.76,12.95 10.26,12.95 10.62,13.31 11.74,13.31 11.94,13.11 11.94,12.34 11.74,12.14 8.79,12.14 8.66,12.27 8.66,12.85

Small or netless copper shapes (teardrops, artwork), in the pictures only: 1 on Top Layer
